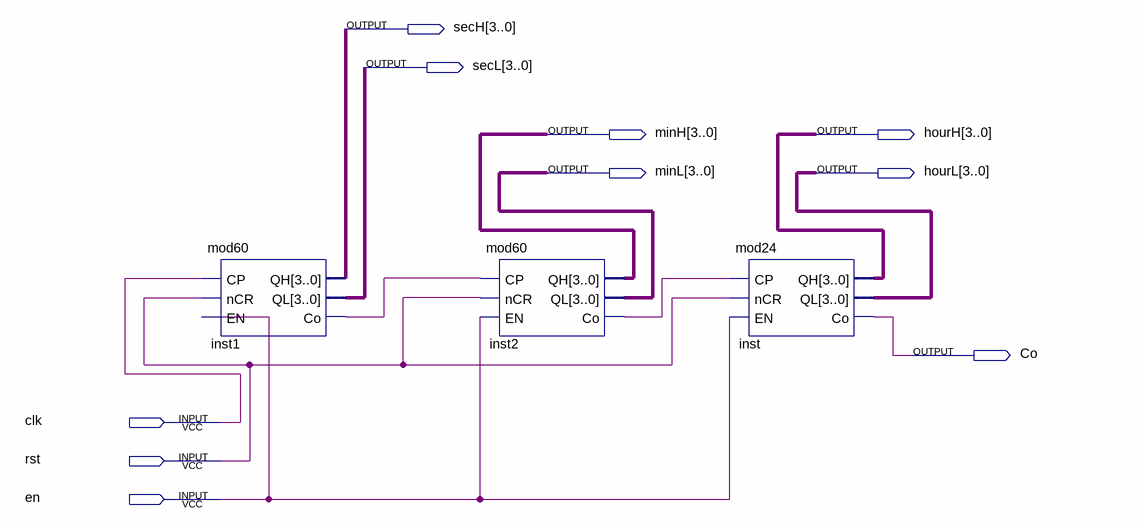
[diagram p0: schematic sheet]
// Quartus schematic clock_non.bdf as structural Verilog: 3 symbols, 10 pins
module clock_non (
  input  clk,
  input  rst,
  input  en,
  output [3:0] secH,
  output [3:0] secL,
  output [3:0] minH,
  output [3:0] hourH,
  output [3:0] minL,
  output [3:0] hourL,
  output Co
);

  wire inst1_co, inst2_co;

  mod60 inst1 (.CP(clk), .nCR(rst), .EN(en), .QH(secH), .QL(secL), .Co(inst1_co));
  mod60 inst2 (.CP(inst1_co), .nCR(rst), .EN(en), .QH(minH), .QL(minL), .Co(inst2_co));
  mod24 inst (.CP(inst2_co), .nCR(rst), .EN(en), .QH(hourH), .QL(hourL), .Co(Co));
endmodule
